# Altium schematic sheet DebugProbe.SchDoc
size 381 x 241 mm
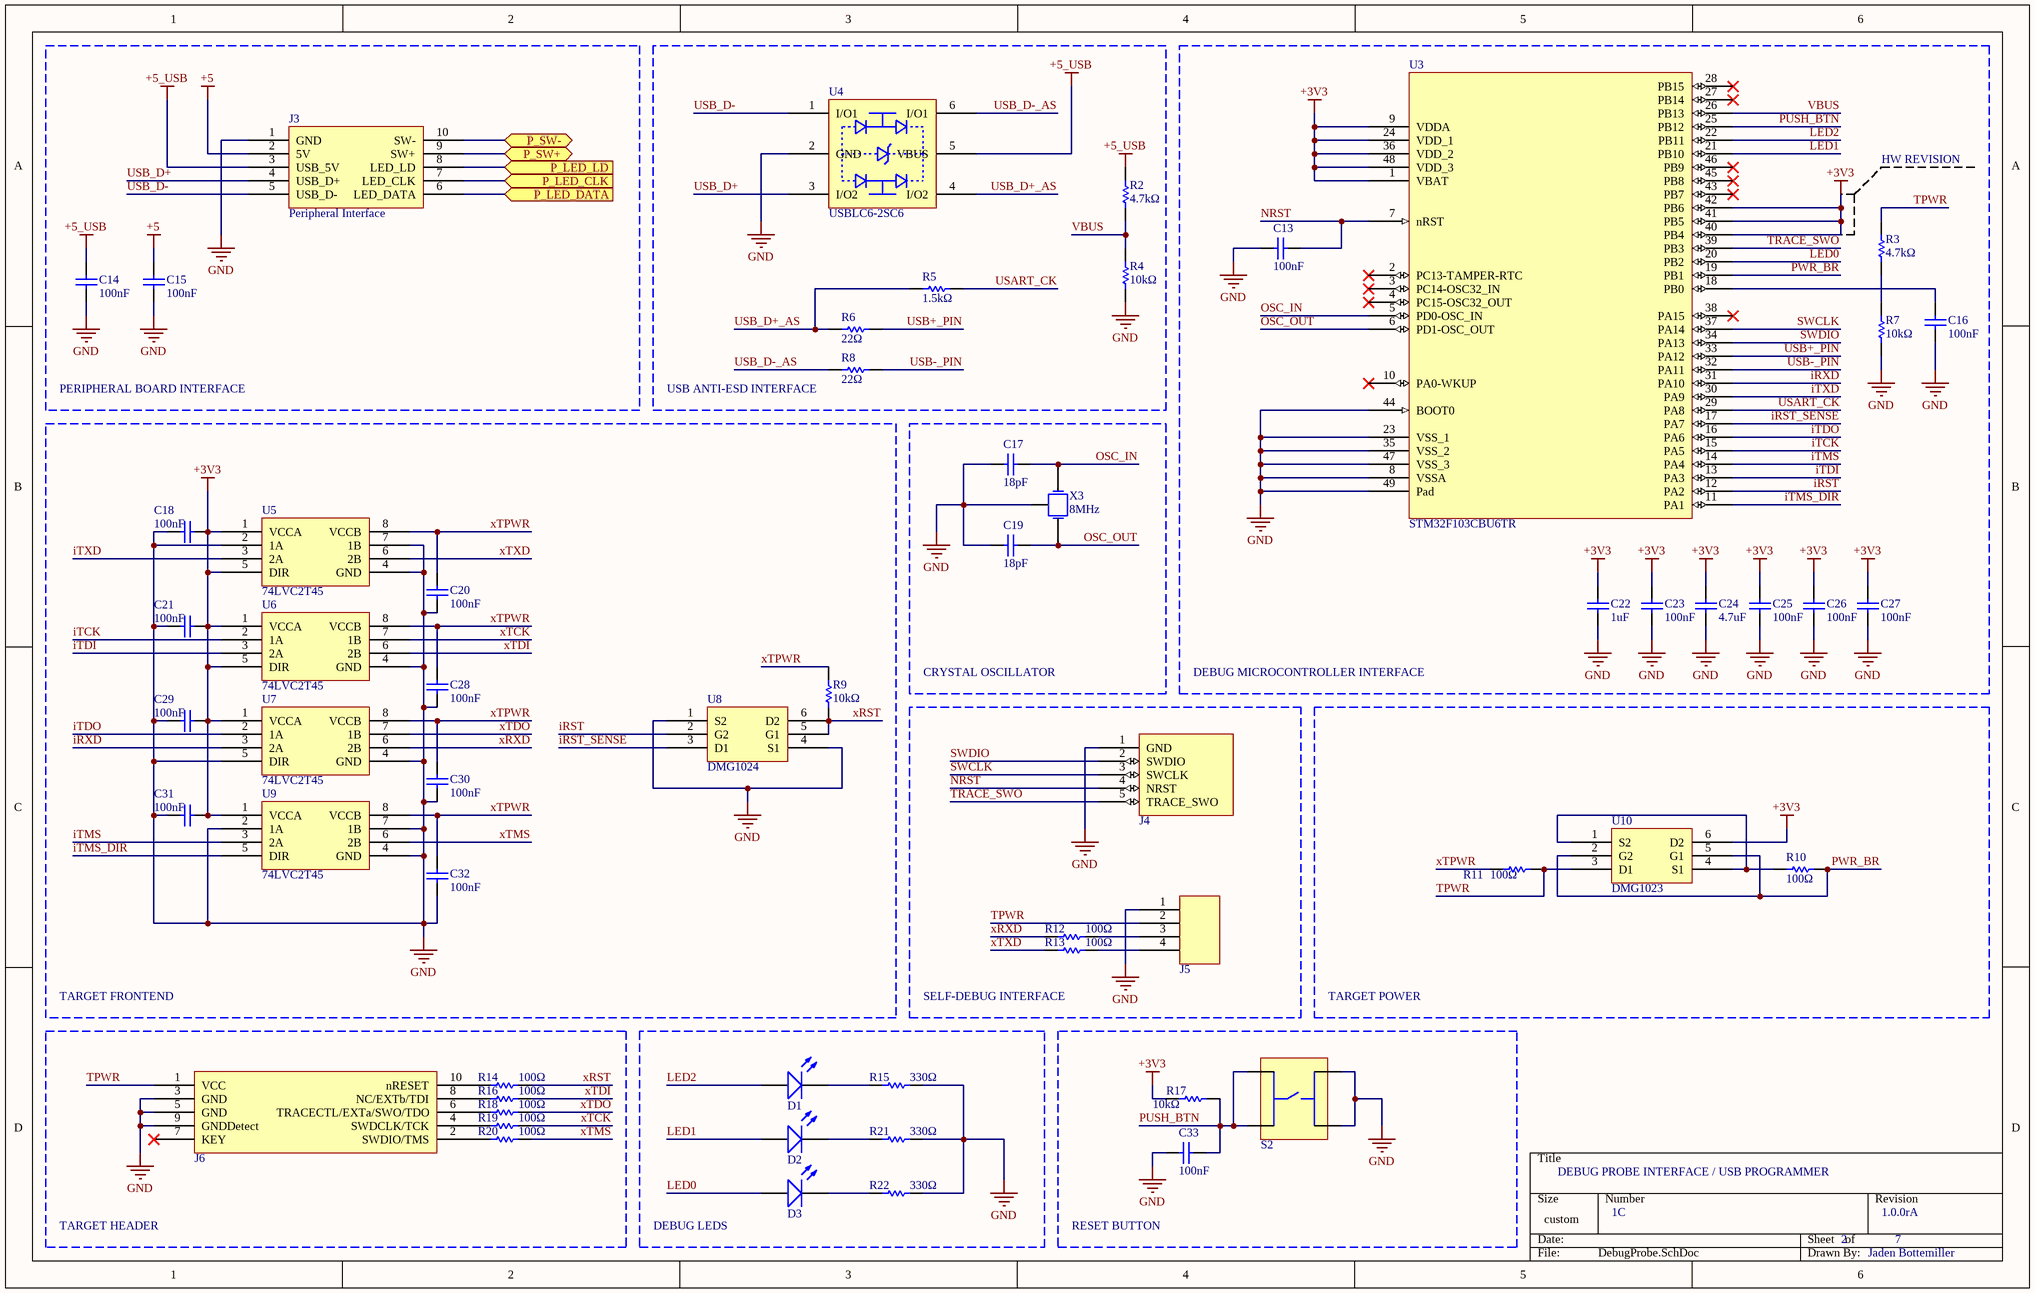
[diagram p0: DebugProbe.SchDoc]

## Parts
C13  value 100nF  (hidden comment: CAP)
C14  value 100nF  (hidden comment: CAP)
C15  value 100nF  (hidden comment: CAP)
C16  value 100nF  (hidden comment: CAP)
C17  value 18pF  (hidden comment: CAP)
C18  value 100nF  (hidden comment: CAP)
C19  value 18pF  (hidden comment: CAP)
C20  value 100nF  (hidden comment: CAP)
C21  value 100nF  (hidden comment: CAP)
C22  value 1uF  (hidden comment: CAP)
C23  value 100nF  (hidden comment: CAP)
C24  value 4.7uF  (hidden comment: CAP)
C25  value 100nF  (hidden comment: CAP)
C26  value 100nF  (hidden comment: CAP)
C27  value 100nF  (hidden comment: CAP)
C28  value 100nF  (hidden comment: CAP)
C29  value 100nF  (hidden comment: CAP)
C30  value 100nF  (hidden comment: CAP)
C31  value 100nF  (hidden comment: CAP)
C32  value 100nF  (hidden comment: CAP)
C33  value 100nF  (hidden comment: CAP)
D1  LED  (value not drawn)
D2  LED  (value not drawn)
D3  LED  (value not drawn)
J3  Peripheral Interface
J4  Debug Header  (value not drawn)
J5  4 Pin Connector  (value not drawn)
J6  Debug Connector  (value not drawn)
R2  value 4.7kΩ  (hidden comment: RES)
R3  value 4.7kΩ  (hidden comment: RES)
R4  value 10kΩ  (hidden comment: RES)
R5  value 1.5kΩ  (hidden comment: RES)
R6  value 22Ω  (hidden comment: RES)
R7  value 10kΩ  (hidden comment: RES)
R8  value 22Ω  (hidden comment: RES)
R9  value 10kΩ  (hidden comment: RES)
R10  value 100Ω  (hidden comment: RES)
R11  value 100Ω  (hidden comment: RES)
R12  value 100Ω  (hidden comment: RES)
R13  value 100Ω  (hidden comment: RES)
R14  value 100Ω  (hidden comment: RES)
R15  value 330Ω  (hidden comment: RES)
R16  value 100Ω  (hidden comment: RES)
R17  value 10kΩ  (hidden comment: RES)
R18  value 100Ω  (hidden comment: RES)
R19  value 100Ω  (hidden comment: RES)
R20  value 100Ω  (hidden comment: RES)
R21  value 330Ω  (hidden comment: RES)
R22  value 330Ω  (hidden comment: RES)
S2  Pushbutton  (value not drawn)
U3  STM32F103CBU6TR
U4  USBLC6-2SC6
U5  74LVC2T45
U6  74LVC2T45
U7  74LVC2T45
U8  DMG1024
U9  74LVC2T45
U10  DMG1023
X3  value 8MHz  (hidden comment: Crystal Oscillator)

## Blocks framed on the sheet
PERIPHERAL BOARD INTERFACE: C14 C15 J3
USB ANTI-ESD INTERFACE: R2 R4-R6 R8 U4
TARGET FRONTEND: C18 C20 C21 C28-C32 R9 U5-U9
CRYSTAL OSCILLATOR: C17 C19 X3
SELF-DEBUG INTERFACE: J4 J5 R12 R13
TARGET POWER: R10 R11 U10
TARGET HEADER: J6 R14 R16 R18-R20
DEBUG LEDS: D1-D3 R15 R21 R22
RESET BUTTON: C33 R17 S2

## Ports
P_LED_CLK (in), P_LED_DATA (in), P_LED_LD (in), P_SW+ (bidir), P_SW- (bidir)

## Nets
+3V3: C18.1 C21.1 C22.2 C23.2 C24.2 C25.2 C26.2 C27.2 C29.1 C31.1 R17.1 U3.1(VBAT) U3.9(VDDA) U3.24(VDD_1) U3.36(VDD_2) U3.40(PB4) U3.41(PB5) U3.42(PB6) U3.48(VDD_3) U5.1(VCCA) U5.5(DIR) U6.1(VCCA) U6.5(DIR) U7.1(VCCA) U9.1(VCCA) U10.6(D2)
+5: C15.2 J3.2(5V)
+5_USB: C14.2 J3.3(USB_5V) R2.2 U4.5(VBUS)
GND: C13.1 C14.1 C15.1 C16.1 C17.2 C18.2 C19.2 C20.2 C21.2 C22.1 C23.1 C24.1 C25.1 C26.1 C27.1 C28.2 C29.2 C30.2 C31.2 C32.2 C33.2 J3.1(GND) J4.1(GND) J5.1(Pin) J6.3(GND) J6.5(GND) J6.9(GNDDetect) R4.1 R7.1 R15.1 R21.1 R22.1 S2.3(Pin) S2.4(Pin) U3.8(VSSA) U3.23(VSS_1) U3.35(VSS_2) U3.44(BOOT0) U3.47(VSS_3) U3.49(Pad) U4.2(GND) U5.2(1A) U5.4(GND) U5.7(1B) U6.4(GND) U7.4(GND) U7.5(DIR) U8.1(S2) U8.4(S1) U9.2(1A) U9.4(GND) U9.7(1B) X3.3(GND)
iRST: U3.12(PA2) U8.2(G2)
iRST_SENSE: U3.17(PA7) U8.3(D1)
iRXD: U3.31(PA10) U7.3(2A)
iTCK: U3.15(PA5) U6.2(1A)
iTDI: U3.13(PA3) U6.3(2A)
iTDO: U3.16(PA6) U7.2(1A)
iTMS: U3.14(PA4) U9.3(2A)
iTMS_DIR: U3.11(PA1) U9.5(DIR)
iTXD: U3.30(PA9) U5.3(2A)
LED0: D3.2(A) U3.20(PB2)
LED1: D2.2(A) U3.21(PB10)
LED2: D1.2(A) U3.22(PB11)
NRST: C13.2 J4.4(NRST) U3.7(nRST)
OSC_IN: C17.1 U3.5(PD0-OSC_IN) X3.1(X1)
OSC_OUT: C19.1 U3.6(PD1-OSC_OUT) X3.2(X2)
P_LED_CLK: J3.7(LED_CLK) ; port P_LED_CLK
P_LED_DATA: J3.6(LED_DATA) ; port P_LED_DATA
P_LED_LD: J3.8(LED_LD) ; port P_LED_LD
P_SW+: J3.9(SW+) ; port P_SW+
P_SW-: J3.10(SW-) ; port P_SW-
PUSH_BTN: C33.1 R17.2 S2.1 S2.2(Pin) U3.25(PB12)
PWR_BR: R10.2 U3.19(PB1) U10.2(G2) U10.5(G1)
SWCLK: J4.3(SWCLK) U3.37(PA14)
SWDIO: J4.2(SWDIO) U3.34(PA13)
TPWR: J5.2(Pin) J6.1(VCC) R3.2 R11.2 U10.3(D1)
TRACE_SWO: J4.5(TRACE_SWO) U3.39(PB3)
USART_CK: R5.1 U3.29(PA8)
USB+_PIN: R6.1 U3.33(PA12)
USB-_PIN: R8.1 U3.32(PA11)
USB_D+: J3.4(USB_D+) U4.3(I/O2)
USB_D+_AS: R5.2 R6.2 U4.4(I/O2)
USB_D-: J3.5(USB_D-) U4.1(I/O1)
USB_D-_AS: R8.2 U4.6(I/O1)
VBUS: R2.1 R4.2 U3.26(PB13)
xRST: R9.2 R14.1 U8.5(G1) U8.6(D2)
xRXD: R12.2 U7.6(2B)
xTCK: R19.1 U6.7(1B)
xTDI: R16.1 U6.6(2B)
xTDO: R18.1 U7.7(1B)
xTMS: R20.1 U9.6(2B)
xTPWR: C20.1 C28.1 C30.1 C32.1 R9.1 R11.1 U5.8(VCCB) U6.8(VCCB) U7.8(VCCB) U9.8(VCCB)
xTXD: R13.2 U5.6(2B)
NetC16_2: C16.2 U3.18(PB0)
NetD1_1: D1.1(K) R15.2
NetD2_1: D2.1(K) R21.2
NetD3_1: D3.1(K) R22.2
NetJ5_3: J5.3(Pin) R12.1
NetJ5_4: J5.4(Pin) R13.1
NetJ6_2: J6.2(SWDIO/TMS) R20.2
NetJ6_4: J6.4(SWDCLK/TCK) R19.2
NetJ6_6: J6.6(TRACECTL/EXTa/SWO/TDO) R18.2
NetJ6_8: J6.8(NC/EXTb/TDI) R16.2
NetJ6_10: J6.10(nRESET) R14.2
NetR3_1: R3.1 R7.2
NetR10_1: R10.1 U10.1(S2) U10.4(S1)

Not connected (* = marked no-connect by the designer): J6 7(KEY)*; U3 2(PC13-TAMPER-RTC)* 3(PC14-OSC32_IN)* 4(PC15-OSC32_OUT)* 10(PA0-WKUP)* 27(PB14)* 28(PB15)* 38(PA15)* 43(PB7)* 45(PB8)* 46(PB9)*

## Notes on the sheet
- HW REVISION
- DEBUG MICROCONTROLLER INTERFACE
- DEBUG PROBE INTERFACE / USB PROGRAMMER
- 1C
- 2
- 1.0.0rA
- 7
- Jaden Bottemiller

## Library data of the parts
C13-C33 = CAP: Standard Capacitor
D1 = LED: Standard LED
D2 = LED: Standard LED; Color: Orange
D3 = LED: Standard LED; Color: YELLOW
J3 = PERIPHERAL_INTERFACE: Interface between peripheral board and control board.
J4 = DBG_5PIN: Five pin Debug Header SWD
J5 = CONN_4PIN: Standard 4 Pin Connector
J6 = Cortex-M Debug: 10-Pin Cortex-M Debug Connector
R2-R22 = RES: Standard Resistor
S2 = PUSHBTN_4T: Standard Pushbutton with 4 Terminals
U3 = STM32F103CBU6TR: IC MCU 32BIT 128KB FLASH LQFP48; ComponentLink1Description: DigiKey; ComponentLink1URL: https://www.digikey.com/product-detail/en/stmicroelectronics/STM32F103CBU6TR/497-18757-1-ND/9958418; ComponentLink2Description: Datasheet; ComponentLink2URL: https://www.st.com/resource/en/datasheet/stm32f103cb.pdf
U4 = USBLC6-2: 17V Clamp 5A (8/20µs) Ipp TVS Diode; ComponentLink1Description: DigiKey; ComponentLink1URL: https://www.digikey.com/product-detail/en/stmicroelectronics/USBLC6-2SC6/497-5235-1-ND/1121688; ComponentLink2Description: Datasheet; ComponentLink2URL: https://www.st.com/content/ccc/resource/technical/document/datasheet/06/1d/48/9c/6c/20/4a/b2/CD00050750.pdf/files/CD00050750.pdf/jcr:content/translations/en.CD00050750.pdf
U5-U7 U9 = 74LVC2T45: Voltage Level Translator Bidirectional 1 Circuit 2 Channel 420Mbps 8-XSON; ComponentLink1Description: DigiKey; ComponentLink1URL: https://www.digikey.com/product-detail/en/nexperia-usa-inc/74LVC2T45GT115/1727-4581-1-ND/2530960; ComponentLink2Description: Datasheet; ComponentLink2URL: https://assets.nexperia.com/documents/data-sheet/74LVC_LVCH2T45.pdf
U8 = DMG1024: Mosfet Array 2 N-Channel (Dual) 20V 1.38A 530mW Surface Mount SOT-563; ComponentLink3Description: DigiKey; ComponentLink3URL: https://www.digikey.com/product-detail/en/diodes-incorporated/DMG1024UV-7/DMG1024UV-7DICT-ND/2270855; ComponentLink4Description: Datasheet; ComponentLink4URL: https://www.diodes.com/assets/Datasheets/ds31974.pdf
U10 = DMG1023: Mosfet Array 2 P-Channel (Dual) 20V 1.03A 530mW Surface Mount SOT-563; ComponentLink1Description: DigiKey; ComponentLink1URL: https://www.digikey.com/product-detail/en/diodes-incorporated/DMG1023UV-7/DMG1023UV-7DICT-ND/2270854; ComponentLink2Description: Datasheet; ComponentLink2URL: https://www.diodes.com/assets/Datasheets/ds31975.pdf
X3 = OSC_1GND: Standard Crystal Oscillator with a ground connection.